# Altium schematic sheet NCS_Wireless_Bed_Unit_Power_Supply.SchDoc
size A
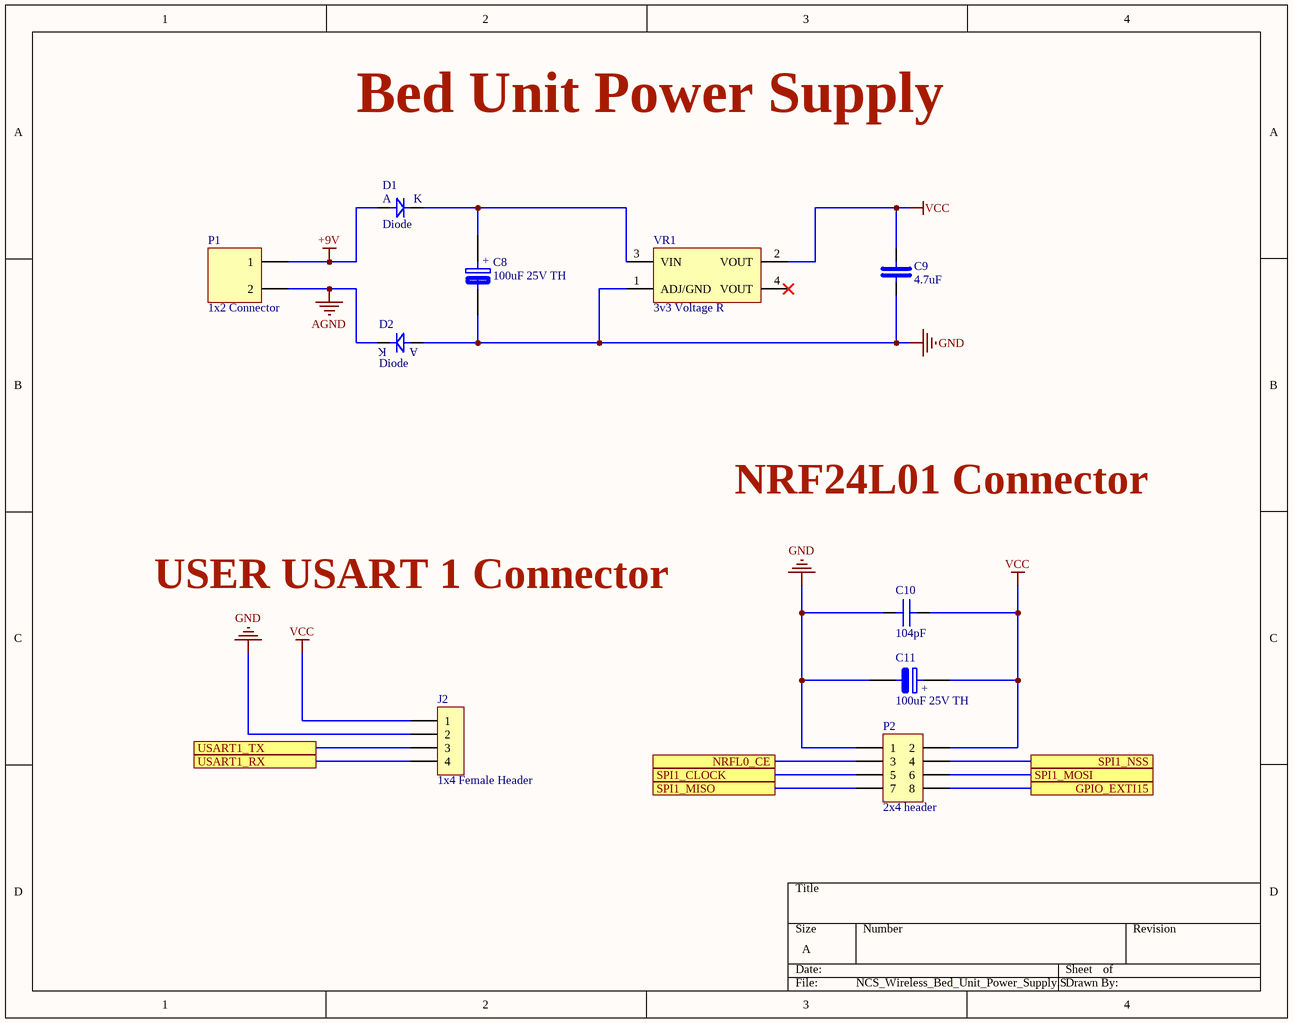
[diagram p0: NCS_Wireless_Bed_Unit_Power_Supply.SchDoc]

## Parts
C8  100uF 25V TH  [100uF 25V TH]
C9  4.7uF  [C0805C209D3HACTU_2pF]
C10  104pF  [C0805C471K3RACTU_470pF]
C11  100uF 25V TH  [100uF 25V TH]
D1  Diode  [CRS06(TE85L,Q,M)_DIODE]
D2  Diode  [CRS06(TE85L,Q,M)_DIODE]
J2  1x4 Female Header  [1x4 Female Header]
P1  1x2 Connector  [1x2 Connector]
P2  2x4 header  [2x4 header]
VR1  3v3 Voltage R  [SAMS1117-33-4N]

## Ports
GPIO_EXTI15, NRFL0_CE, SPI1_CLOCK, SPI1_MISO, SPI1_MOSI, SPI1_NSS, USART1_RX, USART1_TX

## Nets
+9V: D1.1 P1.1
AGND: D2.2 P1.2
GND: C8.2 C9.1 C10.1 C11.2 D2.1 J2.2 P2.1 VR1.1(ADJ/GND)
VCC: C9.2 C10.2 C11.1 J2.1 P2.2 VR1.2(VOUT)
GPIO_EXTI15: P2.8 ; port GPIO_EXTI15
NRFL0_CE: P2.3 ; port NRFL0_CE
SPI1_CLOCK: P2.5 ; port SPI1_CLOCK
SPI1_MISO: P2.7 ; port SPI1_MISO
SPI1_MOSI: P2.6 ; port SPI1_MOSI
SPI1_NSS: P2.4 ; port SPI1_NSS
USART1_RX: J2.4 ; port USART1_RX
USART1_TX: J2.3 ; port USART1_TX
NetC8_1: C8.1 D1.2 VR1.3(VIN)

Not connected (* = marked no-connect by the designer): VR1 4(VOUT)*

## Notes on the sheet
- Bed Unit Power Supply
- NRF24L01 Connector
- USER USART 1 Connector
- (in symbol 860010473007) +
- (in symbol CRS06(TE85L,Q,M)) A; K

## Library data of the parts
C8 C11 = 860010473007: WCAP-ATG8 Aluminum Electrolytic Capacitors; Manufacturer: Wurth Electronics; Leakage Current: 25uA; Pitch: 2.5mm; Supplier 1: Digikey; Manufacturer Part Number: 860010473007; RoHS: Yes; Category: Aluminum Electrolytic Capacitors; Stock 1: 10593; Pricing 1: 1=0.12, 50=0.1, 100=0.0873, 250=0.07832, 500=0.0675 (USD); Voltage Rating (DC): 25V; Length: 11mm; ComponentLink1URL: https://datasheet.ciiva.com/48693/001280151-da-01-en-wcap-atg8-alu-elec-caps-860010473007-48693591.pdf?src-supplier=Conrad; ComponentLink1Description: https://datasheet.ciiva.com/48693/001280151-da-01-en-wcap-atg8-alu-elec-caps-860010473007-48693591.pdf?src-supplier=Conrad; Supplier Part Number 1: 732-8630-1-ND
C9 = C0805C475K3PACTU: Multilayer Ceramic Capacitor, 4.7 uF, 25 V, ï¿½ 10%, X5R, 0805 [2012 Metric]; Manufacturer: KEMET; Material: 4241ConductorMaterial; Dissipation Factor: 5%; Voltage Rating (DC): 25V; Supplier: Mouser; Supplier Part Number: 80-C0805C475K3P; Manufacturer Part Number: C0805C475K3PACTU; RoHS: Yes; Category: Ceramic Capacitors; Stock: 222120; Pricing: 1=0.28, 10=0.131, 50=0.131, 100=0.086, 1000=0.071, 10000=0.045 (USD); Mounting Technology: Surface Mount,PCB; Case/Package: 0805; Pins: 2NUMBER; Case Code (Imperial): 0805; Case Code (Metric): 2012; Min Operating Temperature: -55°C; Max Operating Temperature: 85°C; Value: 4.7uF; Tolerance: 10%; Packaging: Tape and Reel; Dielectric: X5R; Termination: SMD/SMT; Package Quantity: 2500; Series: SMD Comm X5R; Construction: Flat; Length: 2mm; Width: 1.2mm; Height: 1.25mm; Depth: 1.25mm; Thickness: 1.397mm; Radiation Hardening: No; Reach SVHC Compliant: No; RoHS Compliant: Yes; ComponentLink1URL: https://datasheet.ciiva.com/22748/1918694-22748309.pdf?src-supplier=Element14; ComponentLink1Description: https://datasheet.ciiva.com/22748/1918694-22748309.pdf?src-supplier=Element14; ComponentLink2URL: https://datasheet.ciiva.com/18193/getdatasheetpartid-195812-18193898.pdf?src-supplier=Verical; ComponentLink2Description: https://datasheet.ciiva.com/18193/getdatasheetpartid-195812-18193898.pdf?src-supplier=Verical; ComponentLink3URL: https://datasheet.ciiva.com/18193/getdatasheetpartid-385757-18193895.pdf?src-supplier=Verical; ComponentLink3Description: https://datasheet.ciiva.com/18193/getdatasheetpartid-385757-18193895.pdf?src-supplier=Verical
C10 = C0805C471K3RACTU: Capacitor, Ceramic, 470pF, 25VDC, 10-% Tol, 10+% Tol, X7R-TC Code, -15, 15%-TC RoHS Compliant: Yes; Manufacturer: KEMET; Supplier: Mouser; Supplier Part Number: 80-C0805C471K3R; Manufacturer Part Number: C0805C471K3RACTU; RoHS: Yes; Category: Ceramic Capacitors; Stock: 4230; Pricing: 1=0.28, 10=0.127, 50=0.127, 100=0.076, 1000=0.064, 10000=0.05 (USD); ComponentLink1URL: http://www.mouser.com/ds/2/212/KEM_C1002_X7R_SMD-1102033.pdf?src-supplier=Mouser; ComponentLink1Description: http://www.mouser.com/ds/2/212/KEM_C1002_X7R_SMD-1102033.pdf?src-supplier=Mouser; ComponentLink2URL: http://components.arrow.com/part/dataview/3447639S9184872N7429?src-supplier=Arrow+Electronics; ComponentLink2Description: http://components.arrow.com/part/dataview/3447639S9184872N7429?src-supplier=Arrow+Electronics; ComponentLink3URL: http://www.kemet.com/docfinder?Partnumber=C0805C471K3RACTU&src-supplier=Digikey; ComponentLink3Description: http://www.kemet.com/docfinder?Partnumber=C0805C471K3RACTU&src-supplier=Digikey
D1 D2 = CRS06(TE85L,Q,M): Diode Schottky 20V 1A 2-Pin S-FLAT T/R / DIODE SCHOTTKY 20V 1A SFLAT; Manufacturer: Toshiba; Supplier: Digikey; Supplier Part Number: CRS06QMCT-ND; Manufacturer Part Number: CRS06(TE85L,Q,M); RoHS: Yes; Category: Rectifier Diodes; Stock: 4733; Pricing: 1=0.41, 10=0.32, 100=0.2283, 500=0.17242, 1000=0.15438 (USD); ComponentLink1URL: https://datasheet.ciiva.com/887/1764-887142.pdf?src-supplier=Digikey; ComponentLink1Description: https://datasheet.ciiva.com/887/1764-887142.pdf?src-supplier=Digikey; ComponentLink2URL: https://datasheet.ciiva.com/26868/getdatasheetpartid-564949-26868437.pdf?src-supplier=Verical; ComponentLink2Description: https://datasheet.ciiva.com/26868/getdatasheetpartid-564949-26868437.pdf?src-supplier=Verical; ComponentLink3URL: https://datasheet.ciiva.com/4715/1638-15026-4715604.pdf?src-supplier=Mouser; ComponentLink3Description: https://datasheet.ciiva.com/4715/1638-15026-4715604.pdf?src-supplier=Mouser; ComponentLink4URL: https://datasheet.ciiva.com/8290/crs06-datasheet-en-20131101-8290709.pdf?src-supplier=Avnet; ComponentLink4Description: https://datasheet.ciiva.com/8290/crs06-datasheet-en-20131101-8290709.pdf?src-supplier=Avnet; ComponentLink5URL: https://datasheet.ciiva.com/916/dst-crs06-tde-en-1638-916705.pdf?src-supplier=Digikey; ComponentLink5Description: https://datasheet.ciiva.com/916/dst-crs06-tde-en-1638-916705.pdf?src-supplier=Digikey
J2 = PPPC041LFBN-RC: Female, 4 C, Straight, .100"CC; 3.20mm Tail, No Mounting; PBT, Phos. Bronze, 105 C; Manufacturer: Sullins; Supplier 1: Digikey; Manufacturer Part Number: PPPC041LFBN-RC; RoHS: Yes; Category: Connectors; Stock 1: 15423; Pricing 1: 1=0.42, 10=0.338, 100=0.2755, 500=0.23884, 1000=0.2246, 5000=0.2106 (USD); Contact Material: 150ConductorMaterial; Housing Material: 4239ConductorMaterial; Length: 10.7mm; Width: 2.5mm; Height: 8.5mm; Lead Free: 5697LeadFree; ComponentLink1URL: https://media.digikey.com/pdf/Data%20Sheets/Sullins%20PDFs/Female_Headers.100_DS.pdf?src-supplier=Digikey; ComponentLink1Description: https://media.digikey.com/pdf/Data%20Sheets/Sullins%20PDFs/Female_Headers.100_DS.pdf?src-supplier=Digikey; ComponentLink2URL: http://www.sullinscorp.com/catalogs/78_Page80-81_HEADER_.100_2.54mm_FEMALE.pdf?src-supplier=Future+Electronics; ComponentLink2Description: http://www.sullinscorp.com/catalogs/78_Page80-81_HEADER_.100_2.54mm_FEMALE.pdf?src-supplier=Future+Electronics; ComponentLink3URL: https://datasheet.octopart.com/PPPC041LFBN-RC-Sullins-datasheet-41308905.pdf?src-supplier=Future+Electronics; ComponentLink3Description: https://datasheet.octopart.com/PPPC041LFBN-RC-Sullins-datasheet-41308905.pdf?src-supplier=Future+Electronics; Supplier Part Number 1: S7037-ND
P1 = TB006-508-02BE: 2~24 Poles, Screw Type, Horizontal, 5.08 Pitch, 26~14 (AWG), Terminal Block Connector; Manufacturer: CUI; Supplier: Future Electronics; Supplier Part Number: 9117522; Manufacturer Part Number: TB006-508-02BE; RoHS: Yes
P2 = PPTC042LFBN-RC: Header Connector, Pcb Mnt, 8 Contacts, Skt, 0.1 Pitch, Pc Tail Terminal, Locking; Manufacturer: Sullins; Current Rating: 3A; Number of Contacts: 8NUMBER; Supplier: Digikey; Supplier Part Number: S7072-ND; Manufacturer Part Number: PPTC042LFBN-RC; RoHS: Yes; Category: Headers and Wire Housings; Stock: 8036; Pricing: 1=0.63, 10=0.514, 80=0.427, 440=0.36705, 1000=0.34128, 5000=0.3328 (USD); Contact Material: 150,153,154ConductorMaterial; Housing Material: 4239ConductorMaterial; Length: 10.7mm; Width: 5mm; Height: 8.5mm; Lead Free: 5697LeadFree; ComponentLink1URL: https://media.digikey.com/pdf/Data%20Sheets/Sullins%20PDFs/Female_Headers.100_DS.pdf?src-supplier=Digikey; ComponentLink1Description: https://media.digikey.com/pdf/Data%20Sheets/Sullins%20PDFs/Female_Headers.100_DS.pdf?src-supplier=Digikey; ComponentLink2URL: https://datasheet.octopart.com/PPTC042LFBN-RC-Sullins-datasheet-83216130.pdf?src-supplier=Future+Electronics; ComponentLink2Description: https://datasheet.octopart.com/PPTC042LFBN-RC-Sullins-datasheet-83216130.pdf?src-supplier=Future+Electronics
VR1 = AMS1117-33-3.3V